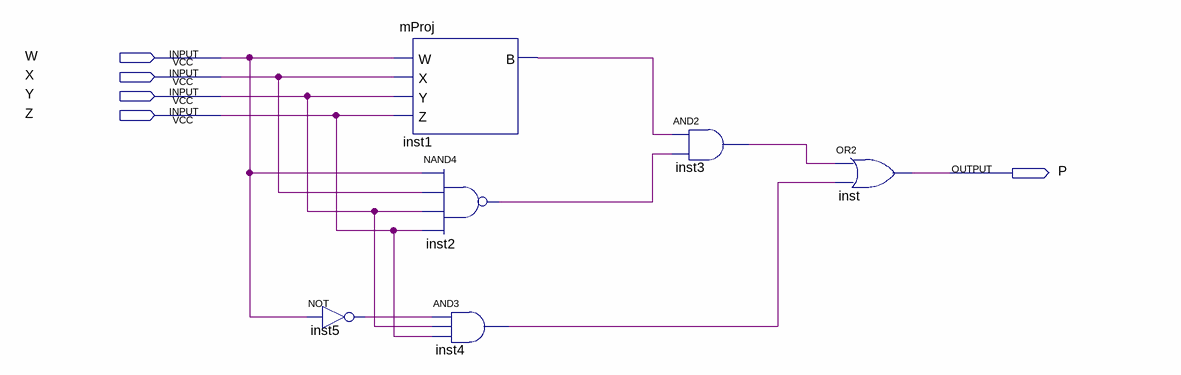
[diagram p0: schematic sheet]
// Quartus schematic mProjFin.bdf as structural Verilog: 6 symbols, 5 pins
module mProjFin (
  input  W,
  input  X,
  input  Y,
  input  Z,
  output P
);

  wire inst1_b, inst2_out, inst3_out, inst4_out, inst5_out;

  not inst5 (inst5_out, W);
  mProj inst1 (.W(W), .X(X), .Y(Y), .Z(Z), .B(inst1_b));
  nand inst2 (inst2_out, W, X, Y, Z);
  and inst4 (inst4_out, inst5_out, Y, Z);
  and inst3 (inst3_out, inst1_b, inst2_out);
  or inst (P, inst3_out, inst4_out);
endmodule
